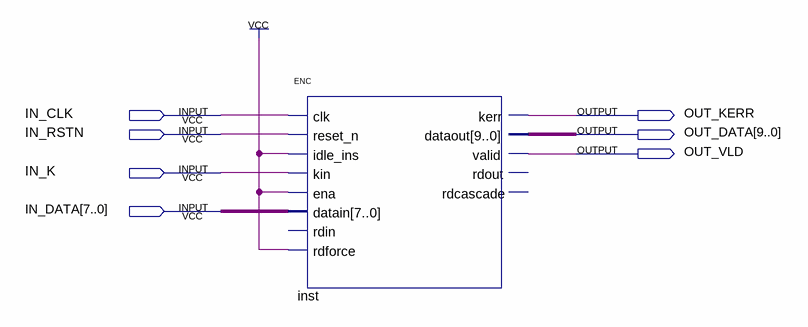
[diagram p0: schematic sheet]
// Quartus schematic TOPIP.bdf as structural Verilog: 1 symbols, 7 pins
module TOPIP (
  input  IN_CLK,
  input  IN_RSTN,
  input  IN_K,
  input  [7:0] IN_DATA,
  output OUT_KERR,
  output [9:0] OUT_DATA,
  output OUT_VLD
);

  ENC inst (
    .clk(IN_CLK), .reset_n(IN_RSTN), .idle_ins(1'b1), .kin(IN_K), .ena(1'b1), .datain(IN_DATA),
    .rdforce(1'b1), .kerr(OUT_KERR), .dataout(OUT_DATA), .valid(OUT_VLD));  // open: rdin, rdout, rdcascade
endmodule
